# Altium schematic sheet heater_control.SchDoc
size A
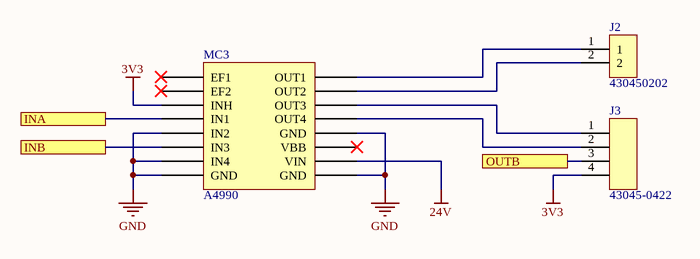
[diagram p0: heater_control.SchDoc]

## Parts
J2  MFG P/N: 430450202  [MOLEX_430450202]  (hidden comment: __Template_Connector_1X2)
J3  MFG P/N: 43045-0422  [MOLEX_MICROFIT_DOUBLE_ROW_RA_TH_4POS_43045-0422]  (hidden comment: CONN_MOLEX_MICROFIT_DOUBLE_ROW_RA_TH_4POS_LOCK)
MC3  A4990  [A4990 Dual Motor Driver Carrier]

## Ports
INA, INB, OUTB

## Nets
3V3: J3.4 MC3.3(INH)
24V: MC3.10(VIN)
GND: MC3.5(IN2) MC3.7(IN4) MC3.8(GND) MC3.9(GND) MC3.12(GND)
INA: MC3.4(IN1) ; port INA
INB: MC3.6(IN3) ; port INB
OUTB: J3.3 ; port OUTB
NetJ2_1: J2.1 MC3.16(OUT1)
NetJ2_2: J2.2 MC3.15(OUT2)
NetJ3_1: J3.1 MC3.14(OUT3)
NetJ3_2: J3.2 MC3.13(OUT4)

Not connected (* = marked no-connect by the designer): MC3 1(EF1)* 2(EF2)* 11(VBB)*

## Library data of the parts
J2 = 958: CONN, HDR, R/A, 2x1, 3MM P, 7.37MM H, GOLD, TH; ID: 958; MFG: Molex, LLC; Connector Type: Header; Pitch: 3.00mm; Number of Positions: 2; Gender: Male; Current Rating: 8A; Voltage, Rated: 600V; Status: Released; RoHS Compliant: Yes; Mounting Type: Through Hole; Orientation: Right Angle; Number of Rows: 1; Features: Board Lock; Supplier 1: Digi-Key; HelpURL: https://www.digikey.in/product-detail/en/molex-llc/0430450202/WM1819-ND/252532; ComponentLink1Description: Datasheet; ComponentLink1URL: https://www.molex.com/pdm_docs/sd/430450202_sd.pdf; Supplier Part Number 1: WM1819-ND
J3 = 164: CONN MOLEX MICROFIT 4POS RA GOLD; ID: 164; MFG: Molex Inc; Pitch: 3.00mm (0.118"); Number of Positions: 4; Gender: Male; COMMON: 210-00301-00; Status: In-Development; RoHS Compliant: Yes; Mounting Type: Through Hole; Orientation: Right Angle; Number of Rows: 2; Row Spacing: 3.00mm (0.118"); Features: Board Lock, Locking Ramp, Shrouded; Supplier 1: Digi-Key; HelpURL: http://www.molex.com/pdm_docs/sd/430450221_sd.pdf; ComponentLink1Description: Datasheet; ComponentLink1URL: http://www.molex.com/pdm_docs/sd/430450221_sd.pdf; LOON: 210-00301-00; XPN: 210-00301-00; Gecko: 210-00301-00
MC3 = A4990 Dual Motor Driver Carrier